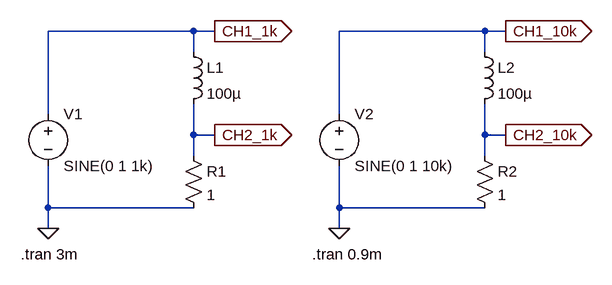
[diagram p0: schematic speaker.asc]
speaker.asc, the LTspice schematic file:
Version 4
SHEET 1 880 680
WIRE 112 -80 -112 -80
WIRE 144 -80 112 -80
WIRE 560 -80 336 -80
WIRE 592 -80 560 -80
WIRE 112 -48 112 -80
WIRE 560 -48 560 -80
WIRE -112 48 -112 -80
WIRE 336 48 336 -80
WIRE 112 80 112 32
WIRE 144 80 112 80
WIRE 560 80 560 32
WIRE 592 80 560 80
WIRE 112 112 112 80
WIRE 560 112 560 80
WIRE -112 192 -112 128
WIRE 112 192 -112 192
WIRE 336 192 336 128
WIRE 560 192 336 192
WIRE -112 224 -112 192
WIRE 336 224 336 192
FLAG -112 224 0
FLAG 144 -80 CH1_1k
IOPIN 144 -80 Out
FLAG 144 80 CH2_1k
IOPIN 144 80 Out
FLAG 336 224 0
FLAG 592 -80 CH1_10k
IOPIN 592 -80 Out
FLAG 592 80 CH2_10k
IOPIN 592 80 Out
SYMBOL voltage -112 32 R0
WINDOW 123 0 0 Left 2
WINDOW 39 0 0 Left 2
SYMATTR InstName V1
SYMATTR Value SINE(0 1 1k)
SYMBOL ind 96 -64 R0
SYMATTR InstName L1
SYMATTR Value 100µ
SYMATTR SpiceLine Rser=5
SYMBOL res 96 96 R0
SYMATTR InstName R1
SYMATTR Value 1
SYMBOL voltage 336 32 R0
WINDOW 123 0 0 Left 2
WINDOW 39 0 0 Left 2
SYMATTR InstName V2
SYMATTR Value SINE(0 1 10k)
SYMBOL ind 544 -64 R0
SYMATTR InstName L2
SYMATTR Value 100µ
SYMATTR SpiceLine Rser=5
SYMBOL res 544 96 R0
SYMATTR InstName R2
SYMATTR Value 1
TEXT -154 264 Left 2 !.tran 3m
TEXT 294 264 Left 2 !.tran 0.9m

The netlist it stands for:
* speaker.asc
V1 CH1_1k 0 SINE(0 1 1k)
L1 CH1_1k CH2_1k 100µ Rser=5
R1 CH2_1k 0 1
V2 CH1_10k 0 SINE(0 1 10k)
L2 CH1_10k CH2_10k 100µ Rser=5
R2 CH2_10k 0 1
.tran 3m
.tran 0.9m
.backanno
.end